# EAGLE board testeri V1.1 (EAGLE 9.6.2)
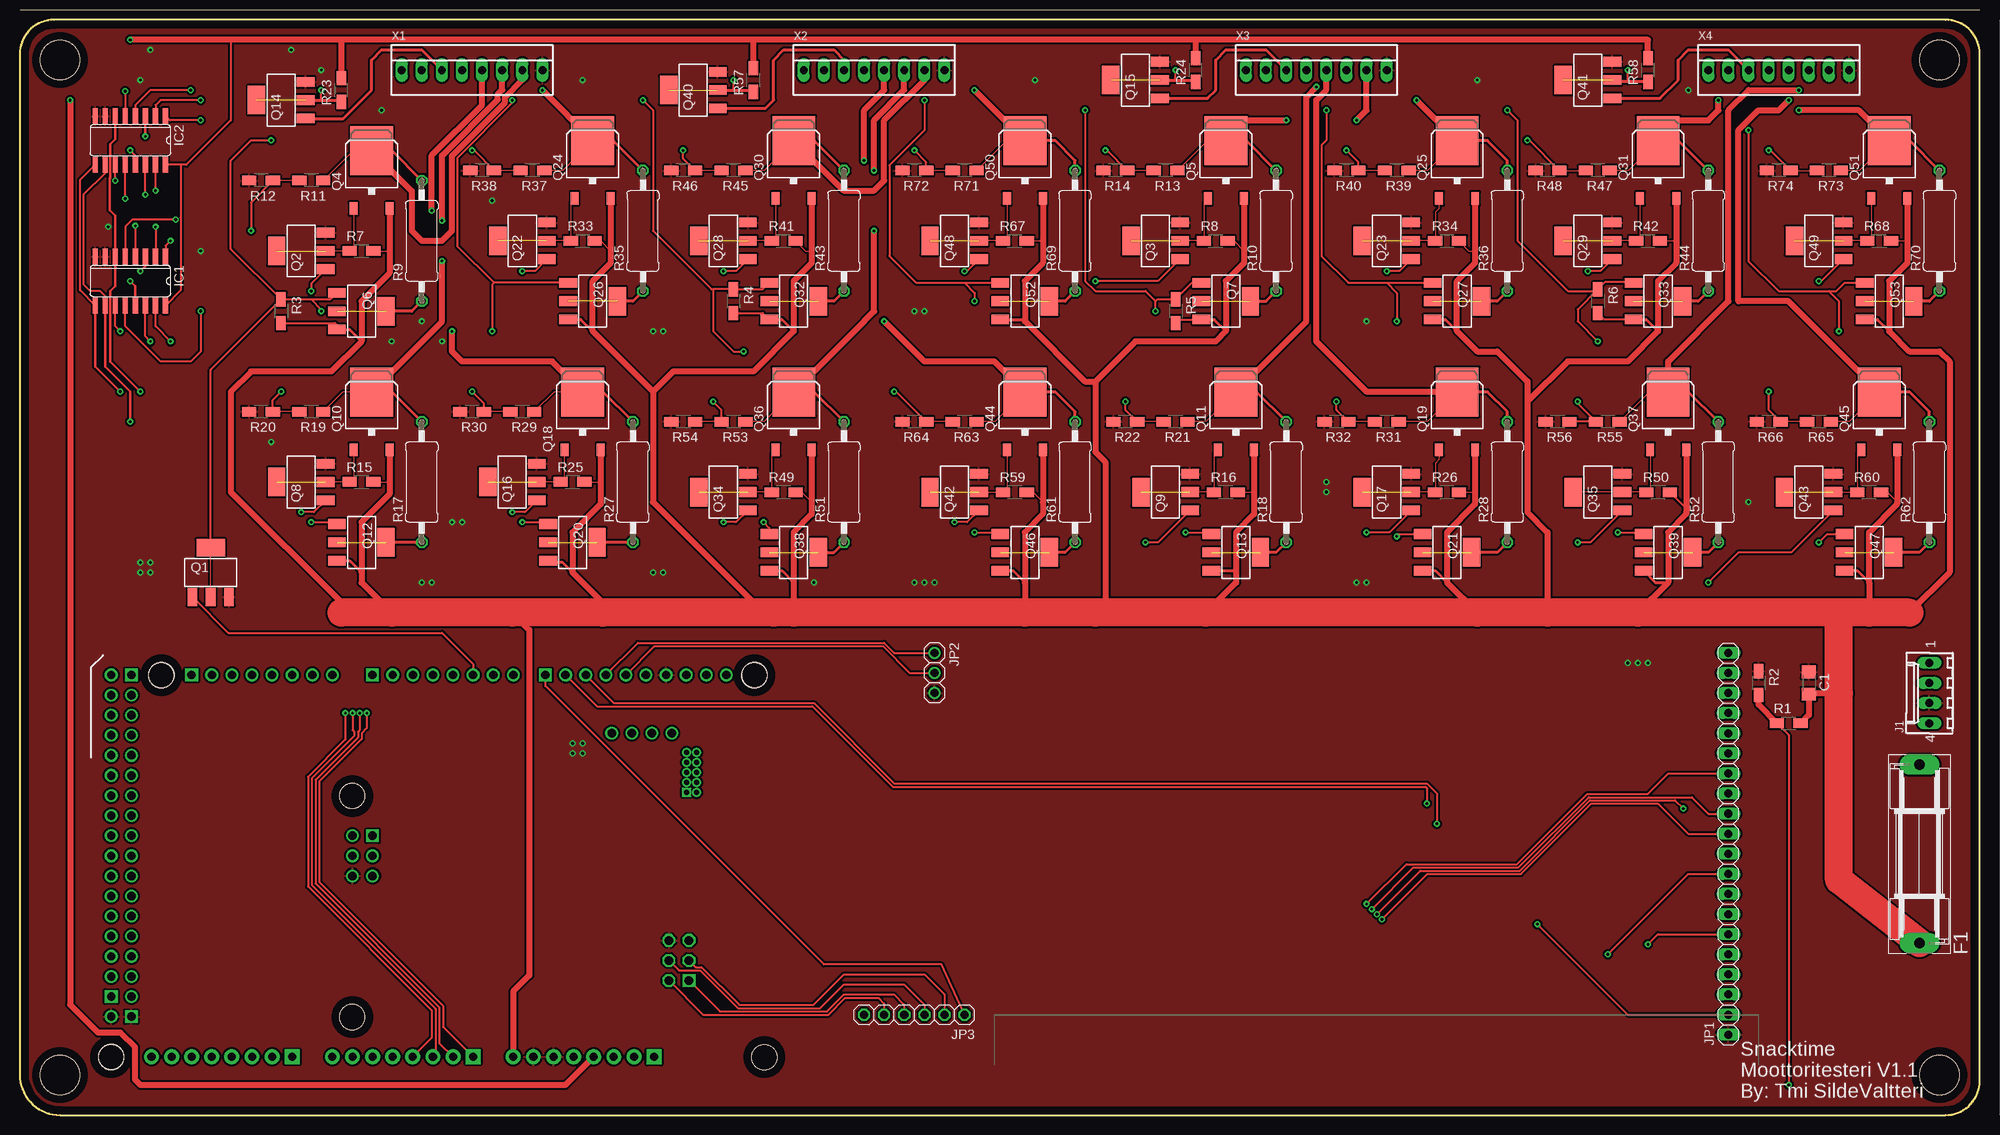
[diagram p5: board, top side]
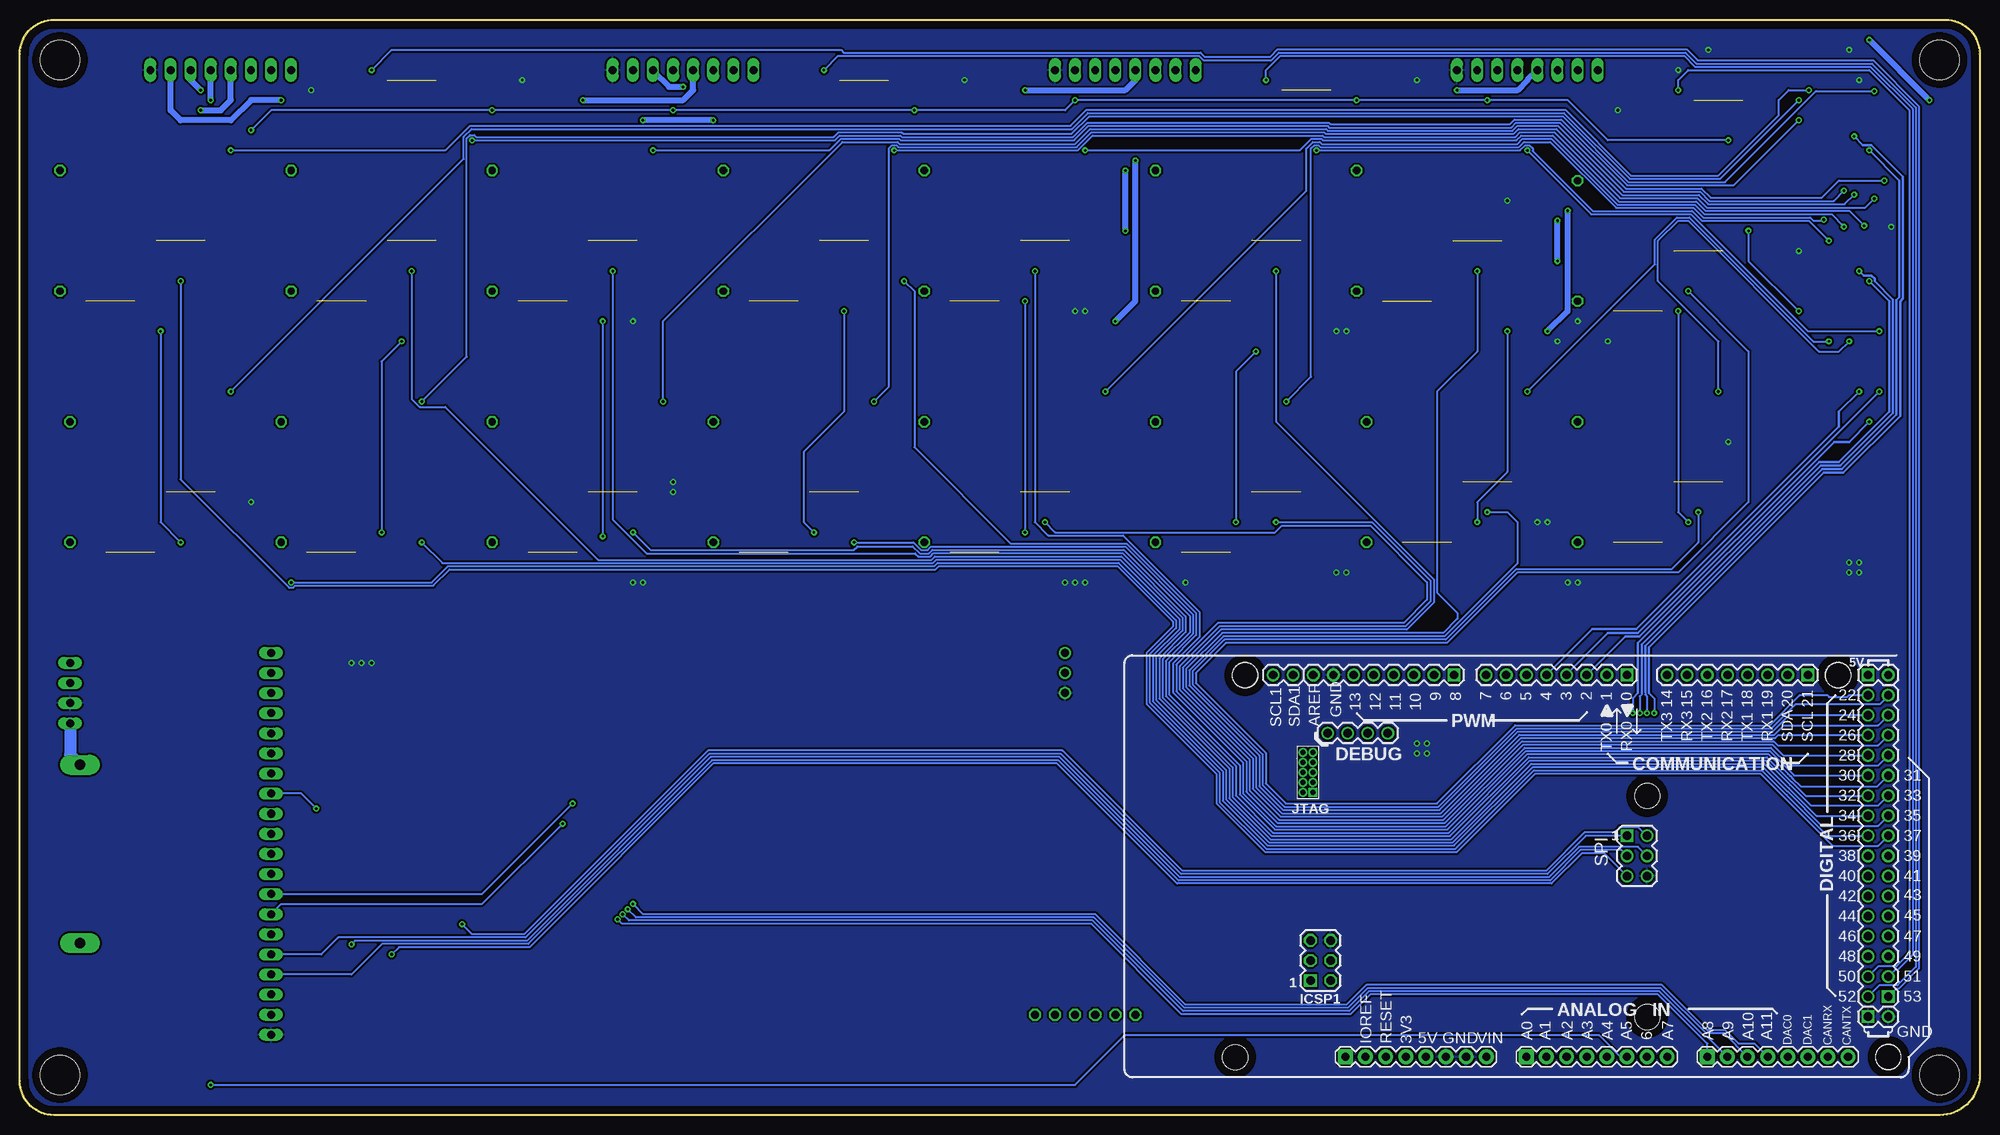
[diagram p6: board, bottom side, seen from below]

Size 247.65 x 138.43 mm. Coordinates in mm from the lower left corner, seen from the top.
Outline: 247.65,4.34 247.65,134.09 arc90 243.31,138.43 4.34,138.43 arc90 0,134.09 0,5.08 arc90 5.08,0 243.31,0 arc90 247.65,4.34
Copper layers (1*16): Top 0.035mm / dielectric 1.5mm / Bottom 0.035mm
Design rules "default": minimum track width 6mil, minimum drill 0.35mm, track to track 6mil, track to pad 6mil, pad to pad 6mil, via to via 6mil, smd to smd 6mil, copper to edge 40mil, drill to drill 6mil, minimum pad ring 10mil, minimum via ring 8mil, stop-mask expansion 4mil, vias tented up to drill 0mil, thermal gap 10mil
Holes 5 mm at 5.08,133.35 5.08,5.08 242.57,5.08 242.57,133.35

## Footprints (pad centres in the part's own frame; a part is rotated, then mirrored left to right if it is on the bottom)
ARDUINO_DUE_SHIELD = drill 1.067 square: 0 63.373,51.816; 5V0_1 93.853,51.816; 8 41.529,51.816; 21 86.233,51.816; 53 96.393,11.176; GND_2 93.853,8.636; MISO 63.373,31.496; MISO2 23.384,13.196 | drill 1.067: 1 60.833,51.816; 2 58.293,51.816; 3 55.753,51.816; 4 53.213,51.816; 5 50.673,51.816; 5V0_2 96.393,51.816; 5V_2 65.913,31.496; 6 48.133,51.816; 7 45.593,51.816; 9 38.989,51.816; 10 36.449,51.816; 11 33.909,51.816; 12 31.369,51.816; 13 28.829,51.816; 14 68.453,51.816; 15 70.993,51.816; 16 73.533,51.816; 17 76.073,51.816; 18 78.613,51.816; 19 81.153,51.816; 20 83.693,51.816; 22 93.853,49.276; 23 96.393,49.276; 24 93.853,46.736; 25 96.393,46.736; 26 93.853,44.196; 27 96.393,44.196; 28 93.853,41.656; 29 96.393,41.656; 30 93.853,39.116; 31 96.393,39.116; 32 93.853,36.576; 33 96.393,36.576; 34 93.853,34.036; 35 96.393,34.036; 36 93.853,31.496; 37 96.393,31.496; 38 93.853,28.956; 39 96.393,28.956; 40 93.853,26.416; 41 96.393,26.416; 42 93.853,23.876; 43 96.393,23.876; 44 93.853,21.336; 45 96.393,21.336; 46 93.853,18.796; 47 96.393,18.796; 48 93.853,16.256; 49 96.393,16.256; 50 93.853,13.716; 51 96.393,13.716; 52 93.853,11.176; AREF 23.749,51.816; GND_3 96.393,8.636; GND_4 26.289,51.816; GND_5 65.913,26.416; GND_7 33.161,44.473; JTAG_TCK 30.621,44.473; JTAG_TMS 28.081,44.473; MASTER_RESET_JTAG 25.541,44.473; MASTER_RESET_SPI 63.373,26.416; MOSI 65.913,28.956; SCL1 18.669,51.816; SDA1 21.209,51.816; SPCK 63.373,28.956 | drill 1.016 pad 1.88: 3V3 35.433,3.556; 5V0 37.973,3.556; A1 53.213,3.556; A2 55.753,3.556; A3 58.293,3.556; A4 60.833,3.556; A5 63.373,3.556; A6 65.913,3.556; A7 68.453,3.556; A9 76.073,3.556; A10 78.613,3.556; A11 81.153,3.556; CANRX 88.773,3.556; CANTX 91.313,3.556; DAC0 83.693,3.556; DAC1 86.233,3.556; GND 40.513,3.556; GND_1 43.053,3.556; IOREF 30.346,3.543; RESET 32.893,3.555; VIN 45.593,3.556 | drill 0.6 pad 1.016 square: 3V3_JTAG 23.689,36.964 | drill 1.067 octagon: 5V_ICSP1 25.924,13.196; GND_ICSP1 25.924,18.276; MOSI2 25.924,15.736; RESET2 23.384,18.276; SCK2 23.384,15.736 | drill 1.016 pad 1.88 square: A0 50.673,3.556; A8 73.533,3.556; NC_2 27.806,3.543 | drill 0.6 pad 1.143: GND_8 23.689,38.234; GND_9 23.689,40.774; GND_10 23.689,42.044; JTAG_RESET 22.419,42.044; JTAG_TCK_2 22.419,38.234; JTAG_TDI 22.419,40.774; JTAG_TDO 22.419,39.504; JTAG_TMS_2 22.419,36.964; NC_5 23.689,39.504 | hole 3.2: 15.113,51.816; 90.043,51.816; 96.393,3.556; 96.418,3.505; 15.138,51.765; 90.068,51.765; 13.868,3.505; 65.938,36.525; 65.938,8.585
C3216 = smd 1.6 x 1.8: 1 -1.4,0; 2 1.4,0
SH22,5 = drill 1.321 pad 2.54 long: 1 -11.252,0; 2 11.252,0
SO16 = smd 0.66 x 2.032: 1 -4.445,-3.073; 2 -3.175,-3.073; 3 -1.905,-3.073; 4 -0.635,-3.073; 5 0.635,-3.073; 6 1.905,-3.073; 7 3.175,-3.073; 8 4.445,-3.073; 9 4.445,3.073; 10 3.175,3.073; 11 1.905,3.073; 12 0.635,3.073; 13 -0.635,3.073; 14 -1.905,3.073; 15 -3.175,3.073; 16 -4.445,3.073
6410-04 = drill 1.016 long: 1 3.81,0; 2 1.27,0; 3 -1.27,0; 4 -3.81,0
1X20 = drill 1.016 long: 1 -24.13,0; 2 -21.59,0; 3 -19.05,0; 4 -16.51,0; 5 -13.97,0; 6 -11.43,0; 7 -8.89,0; 8 -6.35,0; 9 -3.81,0; 10 -1.27,0; 11 1.27,0; 12 3.81,0; 13 6.35,0; 14 8.89,0; 15 11.43,0; 16 13.97,0; 17 16.51,0; 18 19.05,0; 19 21.59,0; 20 24.13,0
1X03 = drill 1.016: 1 -2.54,0; 2 0,0; 3 2.54,0
1X06 = drill 1.016 octagon: 1 -6.35,0; 2 -3.81,0; 3 -1.27,0; 4 1.27,0; 5 3.81,0; 6 6.35,0
SOT223 = smd 1.219 x 2.235: 1 -2.311,-3.099; 2 0,-3.099; 3 2.311,-3.099 | smd 3.6 x 2.2: 4 0,3.099
D-PAK_TO252AA = smd 1 x 1.6: 1 -2.28,-4.8; 3 2.28,-4.8 | smd 5.4 x 6.2: 4 0,2.5
R3216W = smd 1.8 x 1.2: 1 -1.499,0; 2 1.499,0
0411/15 = drill 0.914 octagon: 1 -7.62,0; 2 7.62,0
22-23-2081 = drill 1 long: 1 -8.89,0; 2 -6.35,0; 3 -3.81,0; 4 -1.27,0; 5 1.27,0; 6 3.81,0; 7 6.35,0; 8 8.89,0

## Placement (x,y rotation side)
ARDUINO_DUE1  [ARDUINO_DUE_SHIELD]  107.95,3.81 0 bottom
C1  10uF  [C3216]  226.06,54.61 270 top
F1  3A  [SH22,5]  240.03,33.02 90 top
IC1  74HC4052DD  [SO16]  13.97,105.41 180 top
IC2  74HC4052DD  [SO16]  13.97,123.19 180 top
J1  0022232041  [6410-04]  241.3,53.34 90 top
JP1  [1X20]  215.9,34.29 90 top
JP2  [1X03]  115.57,55.88 270 top
JP3  [1X06]  113.03,12.7 180 top
Q1  BUK98150  [SOT223]  24.13,68.58 0 top
Q2  BUK98150  [SOT223]  35.56,109.22 90 top
Q3  BUK98150  [SOT223]  143.51,110.49 90 top
Q4  IRFR9120NTRLPBF  [D-PAK_TO252AA]  44.45,119.38 0 top
Q5  IRFR9120NTRLPBF  [D-PAK_TO252AA]  152.4,120.65 0 top
Q6  DMP6185SE-13  [SOT223]  43.18,101.6 270 top
Q7  DMP6185SE-13  [SOT223]  152.4,102.87 270 top
Q8  BUK98150  [SOT223]  35.56,80.01 90 top
Q9  BUK98150  [SOT223]  144.78,78.74 90 top
Q10  IRFR9120NTRLPBF  [D-PAK_TO252AA]  44.45,88.9 0 top
Q11  IRFR9120NTRLPBF  [D-PAK_TO252AA]  153.67,88.9 0 top
Q12  DMP6185SE-13  [SOT223]  43.18,72.39 270 top
Q13  DMP6185SE-13  [SOT223]  153.67,71.12 270 top
Q14  BUK98150  [SOT223]  33.02,128.27 90 top
Q15  BUK98150  [SOT223]  140.97,130.81 90 top
Q16  BUK98150  [SOT223]  62.23,80.01 90 top
Q17  BUK98150  [SOT223]  172.72,78.74 90 top
Q18  IRFR9120NTRLPBF  [D-PAK_TO252AA]  71.12,88.9 0 top
Q19  IRFR9120NTRLPBF  [D-PAK_TO252AA]  181.61,88.9 0 top
Q20  DMP6185SE-13  [SOT223]  69.85,72.39 270 top
Q21  DMP6185SE-13  [SOT223]  180.34,71.12 270 top
Q22  BUK98150  [SOT223]  63.5,110.49 90 top
Q23  BUK98150  [SOT223]  172.72,110.49 90 top
Q24  IRFR9120NTRLPBF  [D-PAK_TO252AA]  72.39,120.65 0 top
Q25  IRFR9120NTRLPBF  [D-PAK_TO252AA]  181.61,120.65 0 top
Q26  DMP6185SE-13  [SOT223]  72.39,102.87 270 top
Q27  DMP6185SE-13  [SOT223]  181.61,102.87 270 top
Q28  BUK98150  [SOT223]  88.9,110.49 90 top
Q29  BUK98150  [SOT223]  198.12,110.49 90 top
Q30  IRFR9120NTRLPBF  [D-PAK_TO252AA]  97.79,120.65 0 top
Q31  IRFR9120NTRLPBF  [D-PAK_TO252AA]  207.01,120.65 0 top
Q32  DMP6185SE-13  [SOT223]  97.79,102.87 270 top
Q33  DMP6185SE-13  [SOT223]  207.01,102.87 270 top
Q34  BUK98150  [SOT223]  88.9,78.74 90 top
Q35  BUK98150  [SOT223]  199.39,78.74 90 top
Q36  IRFR9120NTRLPBF  [D-PAK_TO252AA]  97.79,88.9 0 top
Q37  IRFR9120NTRLPBF  [D-PAK_TO252AA]  208.28,88.9 0 top
Q38  DMP6185SE-13  [SOT223]  97.79,71.12 270 top
Q39  DMP6185SE-13  [SOT223]  208.28,71.12 270 top
Q40  BUK98150  [SOT223]  85.09,129.54 90 top
Q41  BUK98150  [SOT223]  198.12,130.81 90 top
Q42  BUK98150  [SOT223]  118.11,78.74 90 top
Q43  BUK98150  [SOT223]  226.06,78.74 90 top
Q44  IRFR9120NTRLPBF  [D-PAK_TO252AA]  127,88.9 0 top
Q45  IRFR9120NTRLPBF  [D-PAK_TO252AA]  234.95,88.9 0 top
Q46  DMP6185SE-13  [SOT223]  127,71.12 270 top
Q47  DMP6185SE-13  [SOT223]  233.68,71.12 270 top
Q48  BUK98150  [SOT223]  118.11,110.49 90 top
Q49  BUK98150  [SOT223]  227.33,110.49 90 top
Q50  IRFR9120NTRLPBF  [D-PAK_TO252AA]  127,120.65 0 top
Q51  IRFR9120NTRLPBF  [D-PAK_TO252AA]  236.22,120.65 0 top
Q52  DMP6185SE-13  [SOT223]  127,102.87 270 top
Q53  DMP6185SE-13  [SOT223]  236.22,102.87 270 top
R1  60K  [R3216W]  223.52,49.53 0 top
R2  20K  [R3216W]  219.71,54.61 270 top
R3  100K  [R3216W]  33.02,101.6 270 top
R4  100K  [R3216W]  90.17,102.87 270 top
R5  100K  [R3216W]  146.05,101.6 270 top
R6  100K  [R3216W]  199.39,102.87 270 top
R7  20K  [R3216W]  43.18,109.22 0 top
R8  20K  [R3216W]  151.13,110.49 0 top
R9  100R  [0411/15]  50.8,110.49 90 top
R10  100R  [0411/15]  158.75,111.76 90 top
R11  60K  [R3216W]  36.83,118.11 180 top
R12  20K  [R3216W]  30.48,118.11 180 top
R13  60K  [R3216W]  144.78,119.38 180 top
R14  20K  [R3216W]  138.43,119.38 180 top
R15  20K  [R3216W]  43.18,80.01 0 top
R16  20K  [R3216W]  152.4,78.74 0 top
R17  100R  [0411/15]  50.8,80.01 90 top
R18  100R  [0411/15]  160.02,80.01 90 top
R19  60K  [R3216W]  36.83,88.9 180 top
R20  20K  [R3216W]  30.48,88.9 180 top
R21  60K  [R3216W]  146.05,87.63 180 top
R22  20K  [R3216W]  139.7,87.63 180 top
R23  5K  [R3216W]  40.64,129.54 90 top
R24  5K  [R3216W]  148.59,132.08 90 top
R25  20K  [R3216W]  69.85,80.01 0 top
R26  20K  [R3216W]  180.34,78.74 0 top
R27  100R  [0411/15]  77.47,80.01 90 top
R28  100R  [0411/15]  187.96,80.01 90 top
R29  60K  [R3216W]  63.5,88.9 180 top
R30  20K  [R3216W]  57.15,88.9 180 top
R31  60K  [R3216W]  172.72,87.63 180 top
R32  20K  [R3216W]  166.37,87.63 180 top
R33  20K  [R3216W]  71.12,110.49 0 top
R34  20K  [R3216W]  180.34,110.49 0 top
R35  100R  [0411/15]  78.74,111.76 90 top
R36  100R  [0411/15]  187.96,111.76 90 top
R37  60K  [R3216W]  64.77,119.38 180 top
R38  20K  [R3216W]  58.42,119.38 180 top
R39  60K  [R3216W]  173.99,119.38 180 top
R40  20K  [R3216W]  167.64,119.38 180 top
R41  20K  [R3216W]  96.52,110.49 0 top
R42  20K  [R3216W]  205.74,110.49 0 top
R43  100R  [0411/15]  104.14,111.76 90 top
R44  100R  [0411/15]  213.36,111.76 90 top
R45  60K  [R3216W]  90.17,119.38 180 top
R46  20K  [R3216W]  83.82,119.38 180 top
R47  60K  [R3216W]  199.39,119.38 180 top
R48  20K  [R3216W]  193.04,119.38 180 top
R49  20K  [R3216W]  96.52,78.74 0 top
R50  20K  [R3216W]  207.01,78.74 0 top
R51  100R  [0411/15]  104.14,80.01 90 top
R52  100R  [0411/15]  214.63,80.01 90 top
R53  60K  [R3216W]  90.17,87.63 180 top
R54  20K  [R3216W]  83.82,87.63 180 top
R55  60K  [R3216W]  200.66,87.63 180 top
R56  20K  [R3216W]  194.31,87.63 180 top
R57  5K  [R3216W]  92.71,130.81 90 top
R58  5K  [R3216W]  205.74,132.08 90 top
R59  20K  [R3216W]  125.73,78.74 0 top
R60  20K  [R3216W]  233.68,78.74 0 top
R61  100R  [0411/15]  133.35,80.01 90 top
R62  100R  [0411/15]  241.3,80.01 90 top
R63  60K  [R3216W]  119.38,87.63 180 top
R64  20K  [R3216W]  113.03,87.63 180 top
R65  60K  [R3216W]  227.33,87.63 180 top
R66  20K  [R3216W]  220.98,87.63 180 top
R67  20K  [R3216W]  125.73,110.49 0 top
R68  20K  [R3216W]  234.95,110.49 0 top
R69  100R  [0411/15]  133.35,111.76 90 top
R70  100R  [0411/15]  242.57,111.76 90 top
R71  60K  [R3216W]  119.38,119.38 180 top
R72  20K  [R3216W]  113.03,119.38 180 top
R73  60K  [R3216W]  228.6,119.38 180 top
R74  20K  [R3216W]  222.25,119.38 180 top
X1  0022232081  [22-23-2081]  57.15,132.08 0 top
X2  0022232081  [22-23-2081]  107.95,132.08 0 top
X3  0022232081  [22-23-2081]  163.83,132.08 0 top
X4  0022232081  [22-23-2081]  222.25,132.08 0 top

## Tracks (layer width: path | path; a pad name or v marks a point on that pad's centre or on a via)
+3V3  (via drill 0.35)
  Top 0.254: 26.67,135.89 26.67,125.73 21.06,120.12 20.32,120.12 | 20.32,120.12 IC2.16 | 20.32,120.12 20.32,113.45 20.34,113.43 20.34,104.26 IC1.16
  Top 0.762: R58.2 205.74,135.89 148.59,135.89 | 148.59,135.89 92.71,135.89 | 92.71,135.89 40.64,135.89 | R23.2 40.64,135.89 | R57.2 92.71,135.89 | R24.2 148.59,135.89 | 40.64,135.89 26.67,135.89 v13.97,135.89 | ARDUINO_DUE1.3V3 68.96,3.81 15.24,3.81 14.55,4.5 14.55,8.61 12.75,10.41 9.91,10.41 6.35,13.97 v6.35,128.27
  Bottom 0.762: v13.97,135.89 v6.35,128.27
+12V
  Top 0.152: R7.2 46.73,109.22 | R15.2 46.73,80.01 | R25.2 73.4,80.01 | R33.2 73.4,110.49 74.67,109.22 | R41.2 99.29,109.22 100.07,109.22 | R49.2 98.8,78.74 100.07,77.47 | R59.2 128.01,78.74 129.28,77.47 | R16.2 155.95,78.74 | R8.2 153.41,110.49 154.68,109.22 | R34.2 183.11,109.22 183.89,109.22 | R68.2 238.5,110.49 | R60.2 235.96,78.74 237.23,77.47 | R42.2 209.29,110.49 | R26.2 183.89,78.74 | R67.2 129.28,110.49
  Top 0.254: R3.2 39.83,100.1 40.64,99.29 | R4.2 93.88,101.37 Q32.3 | R5.2 146.51,100.56 Q7.3 | Q33.3 200.2,100.56 R6.2 | R50.2 210.56,76.69 210.56,76.2
  Top 0.381: Q6.3 40.64,99.29 41.68,99.29 43.18,97.79 | Q12.3 41.68,70.08 43.18,68.58 | 69.85,68.58 68.58,69.85 66.98,69.85 Q20.3 | Q26.3 70.89,100.56 72.39,99.06 | Q32.3 96.29,100.56 97.79,99.06 | Q38.3 96.29,68.81 97.79,67.31 | Q46.3 125.5,68.81 127,67.31 | Q52.3 126.77,100.56 127,100.33 | Q13.3 153.44,68.81 153.67,68.58 | Q27.3 180.11,100.56 181.61,99.06 | Q7.3 150.9,100.56 152.4,99.06 | Q21.3 178.84,68.81 180.34,67.31 | Q53.3 234.72,100.56 236.22,99.06 | Q47.3 232.18,68.81 233.68,67.31 | Q39.3 206.68,67.31 208.28,67.31 | Q33.3 205.51,100.56 207.01,99.06
  Top 0.762: Q4.3 46.73,109.22 46.73,106.42 43.18,102.87 43.18,97.79 39.37,93.98 29.21,93.98 26.67,91.44 26.67,78.74 40.64,64.77 40.64,63.5 | Q10.3 46.73,80.01 46.73,78.48 43.18,74.93 43.18,68.58 43.18,67.31 46.99,63.5 | Q18.3 73.4,80.01 73.4,77.21 69.85,73.66 69.85,68.58 73.66,64.77 73.66,63.5 | Q24.3 74.67,109.22 74.67,107.69 72.39,105.41 72.39,99.06 80.01,91.44 | Q30.3 100.07,109.22 100.07,107.69 97.79,105.41 97.79,99.06 92.71,93.98 82.55,93.98 80.01,91.44 | Q36.3 100.07,77.47 100.07,75.94 97.79,73.66 97.79,67.31 97.79,63.5 | 80.01,91.44 80.01,77.47 93.98,63.5 95.25,63.5 | Q50.3 129.28,110.49 129.28,107.69 127,105.41 127,100.33 134.62,92.71 135.89,92.71 | Q44.3 129.28,77.47 129.28,75.94 127,73.66 127,67.31 127,63.5 | Q5.3 154.68,109.22 154.68,107.69 152.4,105.41 152.4,99.06 151.13,97.79 140.97,97.79 135.89,92.71 | Q11.3 155.95,78.74 155.95,75.94 153.67,73.66 153.67,68.58 153.67,67.31 149.86,63.5 | 135.89,92.71 135.89,83.82 137.16,82.55 137.16,64.77 135.89,63.5 | Q25.3 183.89,109.22 183.89,107.69 181.61,105.41 181.61,99.06 184.15,96.52 186.69,96.52 190.5,92.71 190.5,90.17 | Q19.3 183.89,78.74 183.89,77.21 180.34,73.66 180.34,67.31 184.15,63.5 | Q31.3 209.29,110.49 209.29,107.69 207.01,105.41 207.01,99.06 203.2,95.25 195.58,95.25 190.5,90.17 | 190.5,90.17 190.5,76.2 193.04,73.66 193.04,63.5 | Q37.3 210.56,76.2 210.56,75.94 208.28,73.66 208.28,67.31 204.47,63.5 | Q51.3 238.5,110.49 238.5,107.69 236.22,105.41 236.22,99.06 238.76,96.52 242.57,96.52 243.84,95.25 243.84,68.58 238.76,63.5 | Q45.3 237.23,77.47 237.23,77.21 233.68,73.66 233.68,67.31 233.68,63.5
  Top 0.762: 229.87,53.34 226.19,53.34 C1.2 226.06,50.57 R1.2 | 62.23,63.5 64.39,61.34 64.39,17.65 62.36,15.62 ARDUINO_DUE1.VIN
  Top 3.556: 238.76,63.5 233.68,63.5 229.87,63.5 | 229.87,63.5 204.47,63.5 193.04,63.5 184.15,63.5 149.86,63.5 135.89,63.5 127,63.5 97.79,63.5 95.25,63.5 73.66,63.5 62.23,63.5 46.99,63.5 40.64,63.5 | F1.1 229.87,29.72 229.87,53.34 229.87,63.5
CR_CS
  Top 0.254: JP3.1 116.49,19.05 101.6,19.05 66.42,54.23 ARDUINO_DUE1.8
CR_MISO
  Top 0.254: ARDUINO_DUE1.MISO2 88.47,13.11 102.01,13.11 104.14,15.24 110.49,15.24 111.76,13.97 JP3.4
CR_MOSI
  Top 0.254: ARDUINO_DUE1.MOSI2 83.28,18.29 85.98,18.29 90.23,14.03 90.75,13.51 101.14,13.51 104.14,16.51 111.76,16.51 114.3,13.97 JP3.3
CR_SCK
  Top 0.254: ARDUINO_DUE1.SCK2 85.42,18.69 86.15,18.69 90.92,13.92 100.28,13.92 104.14,17.78 114.3,17.78 116.84,15.24 JP3.2
CR_VCC
  Top 0.254: ARDUINO_DUE1.5V_ICSP1 86.33,12.7 102.18,12.7 104.3,14.83 108.49,14.83 109.22,14.1 JP3.5
ENC_A
  Top 0.254: ARDUINO_DUE1.11 78.11,59.69 109.22,59.69 110.49,58.42 JP2.1
ENC_B
  Top 0.254: ARDUINO_DUE1.12 80.24,59.28 109.05,59.28 112.46,55.88 JP2.2
GND  (via drill 0.35)
  other vias: 15.24,130.81 16.51,134.62 11.18,112.27 22.86,109.22 205.74,57.15 218.44,77.47 204.47,57.15 203.2,57.15 165.1,80.01 165.1,78.74 170.18,100.33 59.69,115.57 115.57,67.31 114.3,67.31 113.03,67.31 69.85,45.72 71.12,45.72 71.12,46.99 69.85,46.99 54.61,74.93 55.88,74.93 80.01,68.58 81.28,68.58 53.34,97.79 80.01,99.06 15.24,69.85 16.51,69.85 16.51,68.58 15.24,68.58 170.18,67.31 168.91,67.31 100.33,67.31 113.03,101.6 114.3,101.6 81.28,99.06 31.75,85.09 50.8,67.31 52.07,67.31 46.99,97.79 50.8,100.33 210.82,129.54 184.15,130.81 128.27,130.81 71.12,130.81 34.29,134.62 38.1,132.08 45.72,127
  pour Top (isolate 0.254): -29.21,147.32 -29.21,12.7 2.54,-19.05 252.73,-19.05 273.05,1.27 273.05,129.54 251.46,151.13 -26.67,151.13 -29.21,148.59
  pour Bottom (isolate 0.254): -22.86,151.13 -22.86,10.16 3.81,-16.51 248.92,-16.51 270.51,5.08 270.51,148.59 247.65,171.45 -2.54,171.45
M1_D  (via drill 0.35)
  Top 0.254: Q2.1 36.83,105.08 v36.83,104.14
  Bottom 0.254: v36.83,104.14 29.21,96.52 29.21,77.47 38.1,68.58 58.42,68.58 67.31,59.69 95.25,59.69 99.06,55.88 99.06,54.61 90.22,45.77 90.22,41.91 87.68,39.37 68.58,39.37 58.67,49.28 26.54,49.28 22.73,53.09 19.27,53.09 19.02,52.83 16.75,52.83 16.49,53.09 ARDUINO_DUE1.22
M1_I  (via drill 0.35)
  Top 0.152: R11.2 R12.1
  Top 0.254: IC1.12 13.34,99.69 17.78,95.25 21.59,95.25 22.86,96.52 v22.86,101.6 | R12.1 29.21,115.34 v29.21,111.76
  Bottom 0.254: v29.21,111.76 29.21,107.95 v22.86,101.6
M2_D  (via drill 0.35)
  Top 0.254: Q8.1 37.16,76.2 v35.56,76.2
  Bottom 0.254: v35.56,76.2 35.56,72.39 38.96,68.99 58.59,68.99 67.48,60.1 95.42,60.1 99.47,56.05 99.47,54.44 90.63,45.6 90.63,41.74 87.85,38.96 68.41,38.96 58.51,48.87 26.31,48.87 23.24,51.94 12.57,51.94 11.56,52.96 ARDUINO_DUE1.23
M2_I  (via drill 0.35)
  Top 0.152: R19.2 R20.1
  Top 0.254: R20.1 31.98,90.4 v33.02,91.44 | v16.51,97.79 15.88,98.43 IC1.14
  Bottom 0.254: v33.02,91.44 33.02,97.79 40.64,105.41 40.64,110.49 38.1,113.03 36.83,113.03 20.32,96.52 17.78,96.52 v16.51,97.79
M3_D  (via drill 0.35)
  Top 0.254: Q16.1 63.83,76.2 v62.23,76.2
  Bottom 0.254: v62.23,76.2 59.69,76.2 58.42,74.93 58.42,69.73 67.65,60.5 95.59,60.5 99.87,56.22 99.87,54.27 91.03,45.43 91.03,41.57 88.02,38.56 68.24,38.56 58.34,48.46 26.15,48.46 24.03,50.58 14.13,50.58 ARDUINO_DUE1.24
M3_I  (via drill 0.35)
  Top 0.152: R29.2 R30.1
  Top 0.254: R30.1 58.65,89.94 v57.15,91.44 | v19.05,97.79 17.15,99.69 IC1.15
  Bottom 0.254: v57.15,91.44 41.05,107.54 41.05,110.66 38.27,113.44 36.66,113.44 21.02,97.79 v19.05,97.79
M4_D  (via drill 0.35)
  Top 0.254: Q22.1 65.1,106.68 v63.5,106.68
  Bottom 0.254: v63.5,106.68 63.5,96.52 68.58,91.44 68.58,66.04 65.99,63.45 65.99,62.73 67.76,60.96 95.7,60.96 100.28,56.39 100.28,54.11 91.44,45.27 91.44,41.41 88.19,38.15 68.08,38.15 58.17,48.06 25.98,48.06 24.76,49.28 12.83,49.28 ARDUINO_DUE1.25
M4_I  (via drill 0.35)
  Top 0.152: R37.2 R38.1
  Top 0.254: R38.1 57.38,121.92 v57.15,121.92 | v12.7,99.06 12.06,99.69 IC1.11
  Bottom 0.254: v57.15,121.92 49.07,113.84 36.49,113.84 21.71,99.06 v12.7,99.06
M5_D  (via drill 0.35)
  Top 0.254: Q28.1 90.5,106.68 v88.9,106.68
  Bottom 0.254: v88.9,106.68 88.9,87.63 68.99,67.72 68.99,64.77 72.39,61.37 95.87,61.37 100.69,56.55 100.69,53.94 91.85,45.1 91.85,41.24 88.35,37.74 67.91,37.74 58,47.65 25.81,47.65 25.43,48.03 14.12,48.03 ARDUINO_DUE1.26
M5_I  (via drill 0.35)
  Top 0.152: R45.2 R46.1
  Top 0.254: R46.1 83.82,120.88 v83.82,121.92 | v19.05,110.49 18.42,109.86 IC1.1
  Bottom 0.254: v83.82,121.92 58.08,121.92 57.42,122.58 56.88,122.58 56.49,122.19 56.49,121.84 48.9,114.25 36.33,114.25 35.11,113.03 21.59,113.03 v19.05,110.49
M6_D  (via drill 0.35)
  Top 0.254: Q34.1 90.5,74.93 v88.9,74.93
  Bottom 0.254: v88.9,74.93 76.78,74.93 69.39,67.55 69.39,64.94 72.56,61.77 96.04,61.77 101.09,56.72 101.09,53.77 92.25,44.93 92.25,41.07 88.52,37.34 67.74,37.34 57.83,47.24 26.03,47.24 25.53,46.74 12.83,46.74 ARDUINO_DUE1.27
M6_I  (via drill 0.35)
  Top 0.152: R53.2 R54.1
  Top 0.254: R53.2 88.67,89.13 v87.63,90.17 | v19.69,113.16 14.2,113.16 13.34,112.29 IC1.5
  Bottom 0.254: v87.63,90.17 84.48,93.32 84.48,122.19 84.09,122.58 83.55,122.58 83.3,122.33 58.25,122.33 57.59,122.98 54.27,122.98 45.95,114.66 36.16,114.66 34.94,113.44 21.42,113.44 21.02,113.03 19.81,113.03 v19.69,113.16
M7_D  (via drill 0.35)
  Top 0.254: Q42.1 119.71,74.93 v118.11,74.93
  Bottom 0.254: v118.11,74.93 116.84,73.66 89.03,73.66 88.19,74.5 76.98,74.5 69.83,67.34 69.83,65.15 72.77,62.21 96.25,62.21 101.52,56.93 101.52,53.56 92.69,44.72 92.69,40.86 88.73,36.91 67.59,36.91 57.66,46.84 26.2,46.84 24.83,45.47 ARDUINO_DUE1.28
M7_I  (via drill 0.35)
  Top 0.152: R63.2 R64.1
  Top 0.254: R64.1 110.72,91.44 v110.49,91.44 | v17.15,112.27 IC1.2
  Bottom 0.254: v110.49,91.44 85.09,116.84 85.09,122.16 84.26,122.98 83.38,122.98 83.13,122.73 58.42,122.73 57.76,123.39 54.11,123.39 45.78,115.06 35.99,115.06 34.77,113.84 18.72,113.84 v17.15,112.27
M8_D  (via drill 0.35)
  Top 0.254: Q48.1 119.71,106.68 v119.38,106.68
  Bottom 0.254: v119.38,106.68 119.38,74.93 117.7,73.25 108.24,73.25 98.6,63.62 98.6,60.43 101.93,57.1 101.93,53.39 93.09,44.55 93.09,40.69 88.9,36.5 67.43,36.5 57.5,46.43 26.37,46.43 24.14,44.2 12.83,44.2 ARDUINO_DUE1.29
M8_I  (via drill 0.35)
  Top 0.152: R71.2 R72.1
  Top 0.254: R72.1 114.53,120.42 v113.03,121.92 | v14.61,112.4 IC1.4
  Bottom 0.254: v113.03,121.92 85.9,121.92 84.43,123.39 83.21,123.39 83.01,123.19 58.53,123.19 57.93,123.8 53.94,123.8 45.61,115.47 35.82,115.47 34.65,114.3 16.51,114.3 v14.61,112.4
M9_D  (via drill 0.35)
  Top 0.254: Q3.1 143.84,105.41 v135.89,105.41
  Bottom 0.254: v135.89,105.41 134.62,104.14 134.62,84.41 122.44,72.24 107.8,72.24 99.01,63.45 99.01,60.66 102.44,57.23 102.44,53.14 93.87,44.56 93.6,44.3 93.5,44.2 93.5,40.52 89.07,36.09 67.26,36.09 57.33,46.03 26.54,46.03 23.44,42.93 ARDUINO_DUE1.30
M9_I  (via drill 0.35)
  Top 0.152: R13.2 R14.1
  Top 0.254: R14.1 137.39,121.92 v137.16,121.92 | v13.34,115.82 IC2.12
  Bottom 0.254: v137.16,121.92 113.96,121.92 112.08,123.8 83.04,123.8 82.84,123.6 58.7,123.6 58.1,124.2 53.77,124.2 45.44,115.88 35.65,115.88 34.48,114.71 14.45,114.71 v13.34,115.82
M10_D  (via drill 0.35)
  Top 0.254: Q9.1 143.84,72.39 v142.24,72.39
  Bottom 0.254: v142.24,72.39 134.75,72.39 133.76,71.4 132.94,71.4 132.51,71.83 107.97,71.83 99.42,63.28 99.42,60.82 102.84,57.4 102.84,52.97 94,44.13 94,40.4 89.3,35.69 67.09,35.69 57.16,45.62 26.71,45.62 24.2,43.11 23.95,42.86 23.61,42.52 23.6,42.52 22.61,41.53 12.95,41.53 ARDUINO_DUE1.31
M10_I  (via drill 0.35)
  Top 0.152: R21.2 R22.1
  Top 0.254: R22.1 139.7,89.13 v139.7,90.17 | v15.88,116.33 IC2.14
  Bottom 0.254: v139.7,90.17 137.82,92.05 137.82,122.19 137.43,122.58 136.89,122.58 136.64,122.33 114.13,122.33 112.25,124.2 82.87,124.2 82.67,124 58.87,124 58.26,124.61 53.49,124.61 45.16,116.28 35.48,116.28 34.31,115.11 17.09,115.11 v15.88,116.33
M11_D  (via drill 0.35)
  Top 0.254: Q17.1 173.05,73.66 v170.18,73.66
  Bottom 0.254: v170.18,73.66 167.92,71.4 142.3,71.4 141.82,71.88 134.82,71.88 133.93,70.99 132.77,70.99 132.34,71.42 108.13,71.42 99.82,63.11 99.82,60.99 103.25,57.56 103.25,52.8 94.41,43.96 94.41,40.23 89.47,35.28 66.92,35.28 56.99,45.21 26.88,45.21 23.78,42.11 23.77,42.11 21.97,40.32 14.16,40.32 ARDUINO_DUE1.32
M11_I  (via drill 0.35)
  Top 0.152: R31.2 R32.1
  Top 0.254: R32.1 166.37,89.13 v166.37,90.17 | v17.15,116.84 IC2.15
  Bottom 0.254: v166.37,90.17 166.37,100.33 143.72,122.98 136.72,122.98 136.47,122.73 114.3,122.73 112.42,124.61 82.57,124.61 82.37,124.41 59.04,124.41 58.43,125.02 53.32,125.02 44.99,116.69 35.31,116.69 34.15,115.52 18.47,115.52 v17.15,116.84
M12_D  (via drill 0.35)
  Top 0.254: Q23.1 174.32,106.68 v172.72,106.68
  Bottom 0.254: v172.72,106.68 172.72,75.27 168.44,70.99 134.5,70.99 134.1,70.59 132.6,70.59 132.17,71.02 108.3,71.02 100.33,63.05 100.33,61.06 103.66,57.73 103.66,52.63 94.82,43.79 94.82,40.06 89.63,34.87 66.75,34.87 56.82,44.81 27.05,44.81 23.95,41.71 23.93,41.71 21.34,39.12 12.83,39.12 ARDUINO_DUE1.33
M12_I  (via drill 0.35)
  Top 0.152: R39.2 R40.1
  Top 0.254: R40.1 169.14,120.42 v167.64,121.92 | v12.06,118.11 IC2.11
  Bottom 0.254: v167.64,121.92 145.35,121.92 143.88,123.39 136.55,123.39 136.35,123.19 114.41,123.19 112.59,125.02 82.4,125.02 82.2,124.82 59.21,124.82 58.6,125.42 53.03,125.42 44.7,117.09 35.15,117.09 33.98,115.93 19.96,115.93 17.78,118.11 v12.06,118.11
M13_D  (via drill 0.35)
  Top 0.254: Q29.1 199.72,106.68 v198.12,106.68
  Bottom 0.254: v198.12,106.68 198.12,90.51 197.12,89.51 193.89,89.51 174.56,70.18 132.44,70.18 132.01,70.61 108.46,70.61 100.74,62.88 100.74,61.23 104.06,57.9 104.06,52.46 95.22,43.62 95.22,39.89 89.8,34.47 66.59,34.47 56.65,44.4 27.21,44.4 24.12,41.3 24.1,41.3 20.65,37.85 ARDUINO_DUE1.34
M13_I  (via drill 0.35)
  Top 0.152: R48.1 R47.2
  Top 0.254: R48.1 190.73,123.19 v190.5,123.19 | v22.86,125.73 18.95,125.73 IC2.1
  Bottom 0.254: v190.5,123.19 144.66,123.19 144.05,123.8 136.38,123.8 136.18,123.6 114.58,123.6 112.76,125.42 82.24,125.42 82.04,125.22 59.38,125.22 58.77,125.83 52.86,125.83 44.54,117.5 31.09,117.5 v22.86,125.73
M14_D  (via drill 0.35)
  Top 0.254: Q35.1 198.45,72.39 v196.85,72.39
  Bottom 0.254: v196.85,72.39 194.23,69.77 132.27,69.77 131.84,70.2 108.63,70.2 101.14,62.71 101.14,61.4 104.47,58.07 104.47,52.3 95.63,43.45 95.63,39.72 89.97,34.06 66.42,34.06 56.49,43.99 27.38,43.99 24.28,40.89 24.27,40.89 19.95,36.58 12.83,36.58 ARDUINO_DUE1.35
M14_I  (via drill 0.35)
  Top 0.254: R56.1 R55.2 196.85,89.94 v196.85,90.17 | v13.34,129.41 IC2.5
  Bottom 0.254: v196.85,90.17 191.16,95.86 191.16,123.46 190.77,123.85 190.23,123.85 189.98,123.6 144.83,123.6 144.22,124.2 136.21,124.2 136.01,124 114.75,124 112.52,126.24 52.7,126.24 44.37,117.91 32.21,117.91 20.7,129.41 v13.34,129.41
M14_US  (via drill 0.35)  (1 unrouted)
  Top 0.254: 38.1,128.27 v38.1,129.54
  Top 0.381: Q14.2 38.1,128.27 40.41,128.27 R23.1
  Bottom 0.254: v38.1,129.54 38.1,130.81 36.83,132.08 13.97,132.08 8.89,127 8.89,20.45 10.54,18.8 12.83,18.8 ARDUINO_DUE1.50
M15_D  (via drill 0.35)
  Top 0.254: Q43.1 223.85,71.12 217.17,71.12 v213.36,67.31
  Bottom 0.254: v213.36,67.31 195.58,67.31 193.52,69.37 132.1,69.37 131.67,69.79 108.8,69.79 101.55,62.54 101.55,61.56 104.88,58.24 104.88,52.13 96.04,43.29 96.04,39.55 90.14,33.66 66.25,33.66 56.32,43.59 27.55,43.59 24.45,40.49 24.44,40.49 19.26,35.31 ARDUINO_DUE1.36
M15_I  (via drill 0.35)
  Top 0.152: R65.2 R66.1
  Top 0.254: R66.1 220.98,89.13 v220.98,91.44 | IC2.2 17.15,127.63 17.78,128.27 v22.86,128.27
  Bottom 0.254: v220.98,91.44 191.56,120.86 191.56,123.63 190.59,124.61 114.72,124.61 112.69,126.64 52.53,126.64 44.22,118.34 32.79,118.34 v22.86,128.27
M16_D  (via drill 0.35)
  Top 0.254: Q49.1 227.66,105.41 v227.33,105.41
  Bottom 0.254: v227.33,105.41 227.33,80.35 213.63,66.65 213.09,66.65 212.84,66.9 195.41,66.9 193.35,68.96 131.93,68.96 131.5,69.39 108.97,69.39 101.96,62.37 101.96,61.73 105.28,58.41 105.28,51.96 96.44,43.12 96.44,39.39 90.31,33.25 66.08,33.25 56.15,43.18 27.72,43.18 24.62,40.08 24.61,40.08 18.56,34.04 12.83,34.04 ARDUINO_DUE1.37
M16_I  (via drill 0.35)
  Top 0.152: R74.1 R73.2
  Top 0.254: R74.1 221.21,121.92 v220.98,121.92 | v21.59,129.54 16.51,129.54 14.61,127.63 IC2.4
  Bottom 0.254: v220.98,121.92 193.85,121.92 190.75,125.02 114.89,125.02 112.86,127.05 52.36,127.05 44.06,118.74 33.02,118.74 25.4,126.36 25.4,128.27 24.13,129.54 v21.59,129.54
M58_US  (via drill 0.35)  (1 unrouted)
  Top 0.254: 90.17,129.54 v90.17,130.81
  Top 0.381: Q40.2 90.17,129.54 92.48,129.54 R57.1
  Bottom 0.254: v90.17,130.81 90.17,132.08 88.38,133.87 37.35,133.87 35.97,132.49 13.8,132.49 8.48,127.17 8.48,20.28 10.37,18.39 10.69,18.39 ARDUINO_DUE1.51
M912_US  (via drill 0.35)  (1 unrouted)
  Top 0.254: 146.05,130.81 v146.05,132.08
  Top 0.381: Q15.2 146.05,130.81 148.36,130.81 R24.1
  Bottom 0.254: v146.05,132.08 144.26,133.87 98.63,133.87 98.12,133.35 89.47,133.35 88.55,134.27 37.18,134.27 35.8,132.89 13.63,132.89 8.08,127.34 8.08,18.72 10.41,16.38 12.7,16.38 ARDUINO_DUE1.52
M1316_US  (via drill 0.35)  (1 unrouted)
  Top 0.254: 203.2,130.58 v203.2,132.08
  Top 0.381: R58.1 203.2,130.58 201.45,130.58 Q41.2
  Bottom 0.254: v203.2,132.08 200.66,134.62 143.89,134.62 143.54,134.27 98.46,134.27 97.95,133.76 89.64,133.76 88.72,134.68 37.01,134.68 35.63,133.3 13.47,133.3 7.67,127.5 7.67,18.55 10.25,15.98 10.57,15.98 ARDUINO_DUE1.53
M_RD
  Top 0.254: Q1.1 26.34,60.96 53.34,60.96 57.28,57.02 ARDUINO_DUE1.5
MUX1_S1  (via drill 0.35)
  Top 0.254: v43.86,50.8 43.86,48.91 43.21,48.26 43.21,47.54 37.84,42.17 37.84,29.47 53.49,13.82 53.49,11.15 ARDUINO_DUE1.A0
  Top 0.305: IC1.13 14.61,104.78 v13.97,105.41
  Bottom 0.254: 43.18,53.34 43.86,52.66 v43.86,50.8
  Bottom 0.305: v13.97,105.41 11.43,102.87 11.43,88.9 17.78,82.55 20.3,82.55 43.18,59.67 43.18,53.34
MUX1_S2  (via drill 0.35)
  Top 0.254: v42.95,50.8 42.95,48.67 42.73,48.46 42.73,47.74 37.36,42.37 37.36,29.28 53.02,13.62 53.02,9.08 ARDUINO_DUE1.A1
  Top 0.305: IC1.3 15.88,107.31 v15.24,106.68
  Bottom 0.254: 42.72,53.34 42.72,53.15 42.95,52.93 v42.95,50.8
  Bottom 0.305: v15.24,106.68 14.65,106.09 13.69,106.09 13.29,105.69 13.29,105.37 10.97,103.06 10.97,88.71 17.59,82.09 20.11,82.09 42.72,59.48 42.72,53.34
MUX2_S1  (via drill 0.35)
  Top 0.254: v42.04,50.8 42.04,48.67 42.26,48.46 42.26,47.94 36.89,42.57 36.89,29.08 52.55,13.42 52.55,7.71 ARDUINO_DUE1.A2
  Top 0.305: IC2.13 14.61,121.28 v13.97,121.92
  Bottom 0.254: 42.27,53.47 42.27,53.15 42.04,52.93 v42.04,50.8
  Bottom 0.305: v13.97,121.92 10.16,118.11 10.16,103.38 10.52,103.02 10.52,88.52 17.4,81.64 19.92,81.64 42.27,59.29 42.27,53.47
MUX2_S2  (via drill 0.35)
  Top 0.254: v41.13,50.8 41.13,47.48 36.41,42.76 36.41,28.88 52.07,13.23 52.07,9.78 ARDUINO_DUE1.A3
  Top 0.305: IC2.3 v15.88,123.7
  Bottom 0.254: 41.81,53.34 41.13,52.66 v41.13,50.8
  Bottom 0.305: v15.88,123.7 14.78,122.6 13.69,122.6 9.7,118.62 9.7,103.19 10.06,102.83 10.06,88.33 17.21,81.18 19.73,81.18 41.81,59.1 41.81,53.34
MUX_E  (via drill 0.35)
  Top 0.305: v15.24,91.44 11.43,95.25 11.43,104.14 12.06,104.78 IC1.6 12.06,113.66 11.38,114.35 11.38,118.39 11.43,118.44 11.43,122.68 12.06,123.32 IC2.6
  Bottom 0.305: v15.24,91.44 17.78,88.9 17.78,87.01 43.37,61.42 48.95,61.42 ARDUINO_DUE1.4
MUXLV_A  (via drill 0.35)
  Top 0.254: IC1.10 10.8,103.5 10.16,104.14 8.89,104.14 8.03,105 8.03,116.31 10.8,119.08 IC2.10
  Top 0.305: IC1.10 10.8,94.62 13.97,91.44 v13.97,87.63
  Bottom 0.305: v13.97,87.63 16.51,85.09 18.4,85.09 42.99,60.5 44.78,60.5 ARDUINO_DUE1.2
MUXLV_B  (via drill 0.35)
  Top 0.254: IC1.9 7.62,104.24 7.62,118.21 IC2.9
  Top 0.305: IC1.9 9.53,94.62 v12.7,91.44
  Bottom 0.305: v12.7,91.44 43.18,60.96 46.99,60.96 52.2,55.75 ARDUINO_DUE1.3
N$1
  Bottom 1.524: J1.4 241.3,45.54 F1.2
N$2  (1 unrouted)
  Top 0.152: Q8.2 R15.1 42.17,80.5 Q10.1
N$3
  Top 0.381: Q14.1 40.87,125.96 44.45,129.54 44.45,133.35 45.72,134.62 50.8,134.62 X1.3
N$4  (via drill 0.35)
  Top 0.152: Q10.4 40.83,91.4 R19.1
  Top 0.381: Q10.4 47.03,91.4 R17.2
  Top 0.762: Q10.4 53.34,100.29 v53.34,107.95 | v53.34,113.03 53.34,121.27 60.4,128.33 60.4,129.03 60.96,129.58 X1.6
  Bottom 0.762: v53.34,107.95 v53.34,113.03
N$5  (via drill 0.35)
  Top 0.152: Q1.2 Q1.4
  Top 0.254: Q1.4 24.13,94.21 R3.1 | R3.1 36.83,103.1 | 36.83,103.1 39.27,103.1 Q6.1 | R3.1 26.67,109.45 26.67,120.65 29.21,123.19 v31.75,123.19 | v62.23,128.27 62.23,127.93 55.27,120.97 55.27,109.83 59.92,105.18 | Q26.1 59.92,105.18 | 59.92,105.18 59.69,104.95 v59.69,99.06 | v63.5,74.93 66.52,74.93 Q20.1 | 36.83,103.1 38.1,101.83 v38.1,101.6 | v36.83,74.93 39.85,74.93 Q12.1 | v78.74,128.27 80.01,127 80.01,111.76 87.4,104.37 87.63,104.37 | 87.63,104.37 R4.1 93.88,104.37 Q32.1 | 87.63,104.37 87.63,99.06 90.17,96.52 v91.44,96.52 | v93.98,74.93 94.69,74.22 Q38.1 | v114.31,128.28 114.31,124.47 109.88,120.04 109.88,108.56 113.26,105.18 119.38,105.18 | 119.38,105.18 Q52.1 | 119.38,105.18 120.65,103.91 v120.65,102.87 | v120.65,73.66 123.67,73.66 Q46.1 | v134.62,127 134.62,105.41 135.89,104.14 142.24,104.14 143.51,102.87 | v143.51,101.6 143.51,102.87 | v147.32,73.66 150.34,73.66 Q13.1 | 143.51,102.87 143.74,103.1 R5.1 148.13,105.18 Q7.1 | v165.1,127 165.1,123.19 164.49,122.58 164.49,108.56 167.87,105.18 172.72,105.18 | 172.72,105.18 Q27.1 | 172.72,105.18 173.99,103.91 v173.99,100.33 | Q21.1 177.22,73.41 174.24,73.41 v173.99,73.15 | v187.96,127 189.23,125.73 189.23,110.49 195.58,104.14 199.16,104.14 R6.1 | Q33.1 203.84,105.26 200.28,105.26 R6.1 | R6.1 196.85,101.83 196.85,100.33 v199.39,97.79 | v201.93,73.66 204.95,73.66 Q39.1 | v218.44,124.46 218.44,107.95 222.25,104.14 228.6,104.14 | Q53.1 230.58,105.18 229.54,104.14 228.6,104.14 | 228.6,104.14 229.87,102.87 v229.87,99.06 | v227.33,72.39 228.37,73.43 Q47.1
  Bottom 0.254: v31.75,123.19 46.99,123.19 52.07,128.27 v62.23,128.27 v78.74,128.27 v114.3,128.27 v114.31,128.28 114.31,128.26 115.57,127 v134.62,127 v165.1,127 v187.96,127 215.9,127 v218.44,124.46 | v59.69,99.06 59.69,81.28 63.5,77.47 v63.5,74.93 | v38.1,101.6 38.1,76.2 v36.83,74.93 | v91.44,96.52 93.98,93.98 v93.98,74.93 | v120.65,102.87 v120.65,73.66 | v143.51,101.6 143.51,88.9 148.59,83.82 148.59,74.93 v147.32,73.66 | v173.99,100.33 v173.99,73.15 | v199.39,97.79 201.93,95.25 v201.93,73.66 | v229.87,99.06 229.87,74.93 v227.33,72.39
N$6  (1 unrouted)
  Top 0.152: Q2.2 R7.1 42.17,109.71 Q4.1
N$7
  Top 0.152: R11.1 42.1,121.88 Q4.4
  Top 0.381: R9.2 47.03,121.88 Q4.4
  Top 0.762: X1.7 63.5,130.83 61.32,128.65 61.32,127.95 54.61,121.24 54.61,111.76 53.34,110.49 50.8,110.49 49.53,111.76 49.53,116.8 Q4.4
N$8  (1 unrouted)
  Top 0.381: R9.1 49.53,101.6 Q6.4
N$9  (1 unrouted)
  Top 0.381: R17.1 Q12.4
N$10
  Top 0.381: Q40.1 94.21,127.23 95.25,128.27 95.25,133.35 96.52,134.62 102.87,134.62 104.14,133.35 X2.3
N$11  (1 unrouted)
  Top 0.152: Q16.2 R25.1 68.84,80.5 Q18.1
N$12  (via drill 0.35)
  Top 0.152: Q18.4 67.5,91.4 R29.1
  Top 0.381: R27.2 73.7,91.4 Q18.4
  Top 0.762: Q18.4 67.27,95.25 55.88,95.25 54.61,96.52 v54.61,99.06 | v52.07,114.3 52.07,121.29 58.42,127.64 X1.5
  Bottom 0.762: v54.61,99.06 52.07,101.6 v52.07,114.3
N$13  (1 unrouted)
  Top 0.381: R27.1 Q20.4
N$14
  Top 0.152: Q30.4 94.02,119.38 R45.1
  Top 0.381: R43.2 100.37,123.15 Q30.4
  Top 0.762: Q30.4 104.1,116.84 107.95,116.84 109.22,118.11 109.22,125.73 114.3,130.81 X2.7
N$15  (1 unrouted)
  Top 0.152: Q22.2 R33.1 69.62,115.36 Q24.1
N$17  (1 unrouted)
  Top 0.381: R35.1 77.47,102.87 Q26.4
N$18  (via drill 0.35)
  Top 0.152: Q36.4 94.02,87.63 R53.1
  Top 0.381: R51.2 100.37,91.4 Q36.4
  Top 0.762: Q36.4 106.68,100.29 106.68,100.33 107.95,101.6 v107.95,111.76 | v107.95,119.38 107.95,125.75 111.76,129.56 X2.6
  Bottom 0.762: v107.95,111.76 v107.95,119.38
N$19  (1 unrouted)
  Top 0.152: Q30.1 95.51,110.98 R41.1 Q28.2
N$20  (1 unrouted)
  Top 0.152: Q5.1 149.63,115.36 R8.1 Q3.2
N$21  (1 unrouted)
  Top 0.381: R43.1 102.87,102.87 Q32.4
N$22  (via drill 0.35)
  Top 0.152: Q44.4 123.23,87.63 R63.1
  Top 0.381: R61.2 133.35,88.9 130.85,91.4 Q44.4
  Top 0.762: Q44.4 123.15,95.25 114.3,95.25 v109.22,100.33 | v106.68,120.65 106.68,127 109.22,129.54 X2.5
  Bottom 0.762: v109.22,100.33 106.68,102.87 v106.68,120.65
N$23  (1 unrouted)
  Top 0.152: Q36.1 95.02,83.61 R49.1 Q34.2
N$24  (1 unrouted)
  Top 0.381: Q7.4 157.48,102.87 R10.1
N$25  (1 unrouted)
  Top 0.381: Q38.4 102.87,71.12 R51.1
N$26  (via drill 0.35)
  Top 0.152: Q50.4 124.65,123.15 R71.1
  Top 0.381: R69.2 133.35,120.65 130.85,123.15 Q50.4
  Top 0.762: Q50.4 v120.61,129.54
  Bottom 0.762: v120.61,129.54 107.95,129.54 106.68,130.81 X2.4
N$27  (1 unrouted)
  Top 0.152: Q42.2 R59.1 124.72,79.23 Q44.1
N$28  (1 unrouted)
  Top 0.152: Q9.2 R16.1 150.9,83.61 Q11.1
N$29  (1 unrouted)
  Top 0.381: R61.1 132.08,71.12 Q46.4
N$30  (via drill 0.35)
  Top 0.152: Q24.4 68.62,119.38 R37.1
  Top 0.381: R35.2 74.97,123.15 Q24.4
  Top 0.762: v66.04,129.54 66.04,129.5 Q24.4
  Bottom 0.762: X1.4 57.13,130.83 57.13,130.79 58.39,129.54 v66.04,129.54
N$31  (1 unrouted)
  Top 0.152: Q50.1 124.72,110.98 R67.1 Q48.2
N$32  (1 unrouted)
  Top 0.381: R18.1 158.75,71.12 Q13.4
N$33  (1 unrouted)
  Top 0.381: R69.1 132.08,102.87 Q52.4
N$34  (1 unrouted)
  Top 0.152: Q19.1 179.33,82.83 178.84,82.34 R26.1 Q17.2
N$35  (1 unrouted)
  Top 0.381: R28.1 186.69,71.12 Q21.4
N$36  (1 unrouted)
  Top 0.152: Q23.2 R34.1 178.84,114.09 179.33,114.58 Q25.1
N$37  (1 unrouted)
  Top 0.381: R36.1 186.69,102.87 Q27.4
N$38
  Top 0.381: Q15.1 150.09,128.5 151.13,129.54 151.13,133.35 152.4,134.62 157.48,134.62 X3.3
N$39  (via drill 0.35)
  Top 0.152: Q5.4 150.05,123.15 R13.1
  Top 0.381: R10.2 154.98,123.15 Q5.4
  Top 0.762: Q5.4 154.98,125.73 v160.02,125.73 | v168.91,125.73 170.18,127 X3.7
  Bottom 0.762: v160.02,125.73 v168.91,125.73
N$40  (via drill 0.35)
  Top 0.152: Q11.4 149.9,87.63 R21.1
  Top 0.381: R18.2 156.25,91.4 Q11.4
  Top 0.762: Q11.4 162.56,100.29 162.56,128.67 v163.83,129.94
  Bottom 0.762: X3.6 167.64,131.95 165.63,129.94 v163.83,129.94
N$41
  Top 0.152: Q19.4 177.84,87.63 R31.1
  Top 0.381: R28.2 187.96,88.9 185.46,91.4 Q19.4
  Top 0.762: Q19.4 170.22,91.4 163.83,97.79 163.83,128.27 165.1,129.54 X3.5
N$42  (via drill 0.35)
  Top 0.152: Q25.4 177.84,119.38 R39.1
  Top 0.381: R36.2 187.96,120.65 185.46,123.15 Q25.4
  Top 0.762: Q25.4 v176.49,128.27
  Bottom 0.762: v176.49,128.27 163.83,128.27 162.56,129.54 X3.4
N$44  (1 unrouted)
  Top 0.152: Q31.1 204.73,110.98 R42.1 Q29.2
N$45  (1 unrouted)
  Top 0.381: R44.1 212.09,102.87 Q33.4
N$46
  Top 0.152: Q37.1 206,79.23 R50.1 Q35.2 Q35.4
N$47  (1 unrouted)
  Top 0.381: R52.1 213.36,71.12 Q39.4
N$48  (1 unrouted)
  Top 0.152: Q45.1 232.18,83.61 R60.1 Q43.2
N$49  (1 unrouted)
  Top 0.381: R62.1 240.03,71.12 Q47.4
N$50  (1 unrouted)
  Top 0.152: Q51.1 233.94,110.98 R68.1 Q49.2
N$51  (1 unrouted)
  Top 0.381: R70.1 241.3,102.87 Q53.4
N$52
  Top 0.381: Q41.1 207.24,128.5 209.55,130.81 209.55,133.35 210.82,134.62 215.9,134.62 X4.3
N$53  (via drill 0.35)
  Top 0.152: Q31.4 203.24,119.38 R47.1
  Top 0.381: R44.2 209.59,123.15 Q31.4
  Top 0.762: Q31.4 209.59,125.73 213.36,125.73 214.63,127 v214.63,128.27
  Bottom 0.762: v214.63,128.27 218.44,128.27 220.98,125.73 227.33,125.73 228.6,127 X4.7
N$54  (via drill 0.35)
  Top 0.152: R55.1 205.93,91.4 Q37.4
  Top 0.381: R52.2 210.86,91.4 Q37.4
  Top 0.762: Q37.4 208.28,95.25 215.9,102.87 215.9,126.98 218.46,129.54 v224.79,129.54
  Bottom 0.762: v224.79,129.54 226.06,130.81 X4.6
N$55  (via drill 0.35)
  Top 0.152: Q45.4 231.18,87.63 R65.1
  Top 0.381: R62.2 241.3,88.9 238.8,91.4 Q45.4
  Top 0.762: Q45.4 223.48,102.87 217.17,102.87 217.17,124.48 219.69,127 222.25,127 v223.52,128.27
  Bottom 0.762: v223.52,128.27 X4.5
N$56  (via drill 0.35)
  Top 0.152: Q51.4 232.45,119.38 R73.1
  Top 0.381: R70.2 238.8,123.15 Q51.4
  Top 0.762: Q51.4 232.37,127 v224.79,127
  Bottom 0.762: v224.79,127 222.25,127 220.98,128.27 X4.4
PSU_U  (via drill 0.35)
  Top 0.254: R1.1 223.52,48.03 v223.52,3.81
  Top 0.762: R1.1 219.71,51.84 R2.2
  Bottom 0.254: ARDUINO_DUE1.A5 45.39,7.37 48.09,10.06 108.05,10.06 114.3,3.81 v223.52,3.81
S_CLK
  Bottom 0.254: ARDUINO_DUE1.SPCK 45.31,33.5 50.44,33.5 54.27,29.67 101.24,29.67 116.43,44.86 160.19,44.86 183.4,21.64 201.88,21.64 205.74,17.78 JP1.4
S_CS  (via drill 0.35)
  Top 0.254: ARDUINO_DUE1.10 75.06,52.07 100.33,52.07 110.49,41.91 177.8,41.91 179.07,40.64 v179.07,36.83
  Bottom 0.254: JP1.7 214.63,26.67 189.23,26.67 v179.07,36.83
S_D/C  (via drill 0.35)
  Top 0.254: ARDUINO_DUE1.9 72.92,51.66 100.16,51.66 110.32,41.5 177.63,41.5 177.8,41.34 v177.8,39.37
  Bottom 0.254: JP1.8 189.23,27.94 v177.8,39.37
S_MISO
  Bottom 0.254: ARDUINO_DUE1.MISO 49.78,35.31 54.61,30.48 100.91,30.48 116.09,45.67 160.53,45.67 183.74,22.45 207.42,22.45 209.55,20.32 JP1.5
S_MOSI  (via drill 0.35)
  Top 0.254: v205.74,21.59 207.01,22.86 JP1.6
  Bottom 0.254: ARDUINO_DUE1.MOSI 43.18,33.91 50.61,33.91 54.44,30.07 101.07,30.07 116.26,45.26 160.36,45.26 183.57,22.05 205.28,22.05 v205.74,21.59
S_RST  (via drill 0.35)
  Top 0.254: v200.66,20.32 210.82,30.48 JP1.9
  Bottom 0.254: ARDUINO_DUE1.MASTER_RESET_SPI 47.45,33.1 50.27,33.1 54.11,29.26 101.41,29.26 116.6,44.45 160.02,44.45 183.24,21.23 199.75,21.23 v200.66,20.32
S_X+  (via drill 0.35)
  Top 0.254: v170.82,26.03 176.09,31.29 189.35,31.29 198.24,40.18 211.28,40.18 213.36,38.1 JP1.12
  Bottom 0.254: ARDUINO_DUE1.A10 32.28,10.31 34.56,10.31 40.3,16.05 77.35,16.05 79.84,13.56 100.5,13.56 111.93,24.99 169.79,24.99 v170.82,26.03
S_X-  (via drill 0.35)
  Top 0.254: v170.18,26.67 175.21,31.7 189.18,31.7 198.07,40.59 205.69,40.59 208.28,43.18 JP1.14
  Bottom 0.254: ARDUINO_DUE1.A11 28.45,9.02 30.41,9.02 32.12,10.72 34.4,10.72 40.14,16.46 77.52,16.46 80.01,13.97 100.33,13.97 111.76,25.4 168.91,25.4 v170.18,26.67
S_Y+  (via drill 0.35)
  Top 0.254: v172.11,24.74 177.85,30.48 189.68,30.48 198.57,39.37 207.01,39.37 210.82,35.56 JP1.11
  Bottom 0.254: ARDUINO_DUE1.A8 34.42,9.02 40.64,15.24 77.02,15.24 79.5,12.75 100.84,12.75 112.27,24.18 171.55,24.18 v172.11,24.74
S_Y-  (via drill 0.35)
  Top 0.254: v171.47,25.39 176.97,30.89 189.52,30.89 198.41,39.78 209.14,39.78 v210.19,38.73
  Bottom 0.254: ARDUINO_DUE1.A9 34.42,9.91 34.73,9.91 40.47,15.65 77.18,15.65 79.67,13.16 100.67,13.16 112.1,24.59 170.67,24.59 v171.47,25.39 | v210.19,38.73 212.09,40.64 JP1.13
SPI_5V  (via drill 0.35)
  Top 0.254: v191.77,24.13 203.2,12.7 JP1.2
  Bottom 0.254: ARDUINO_DUE1.5V_2 43.12,36.39 45.49,36.39 46.17,35.71 49.95,35.71 54.78,30.89 100.74,30.89 115.93,46.08 160.69,46.08 183.91,22.86 190.5,22.86 v191.77,24.13

## Text on the board
tPlace: Snacktime / Moottoritesteri V1.1 / By: Tmi SildeValtteri